# Altium schematic sheet NNLightSwitcher_eMMC_SD.SchDoc
size A4
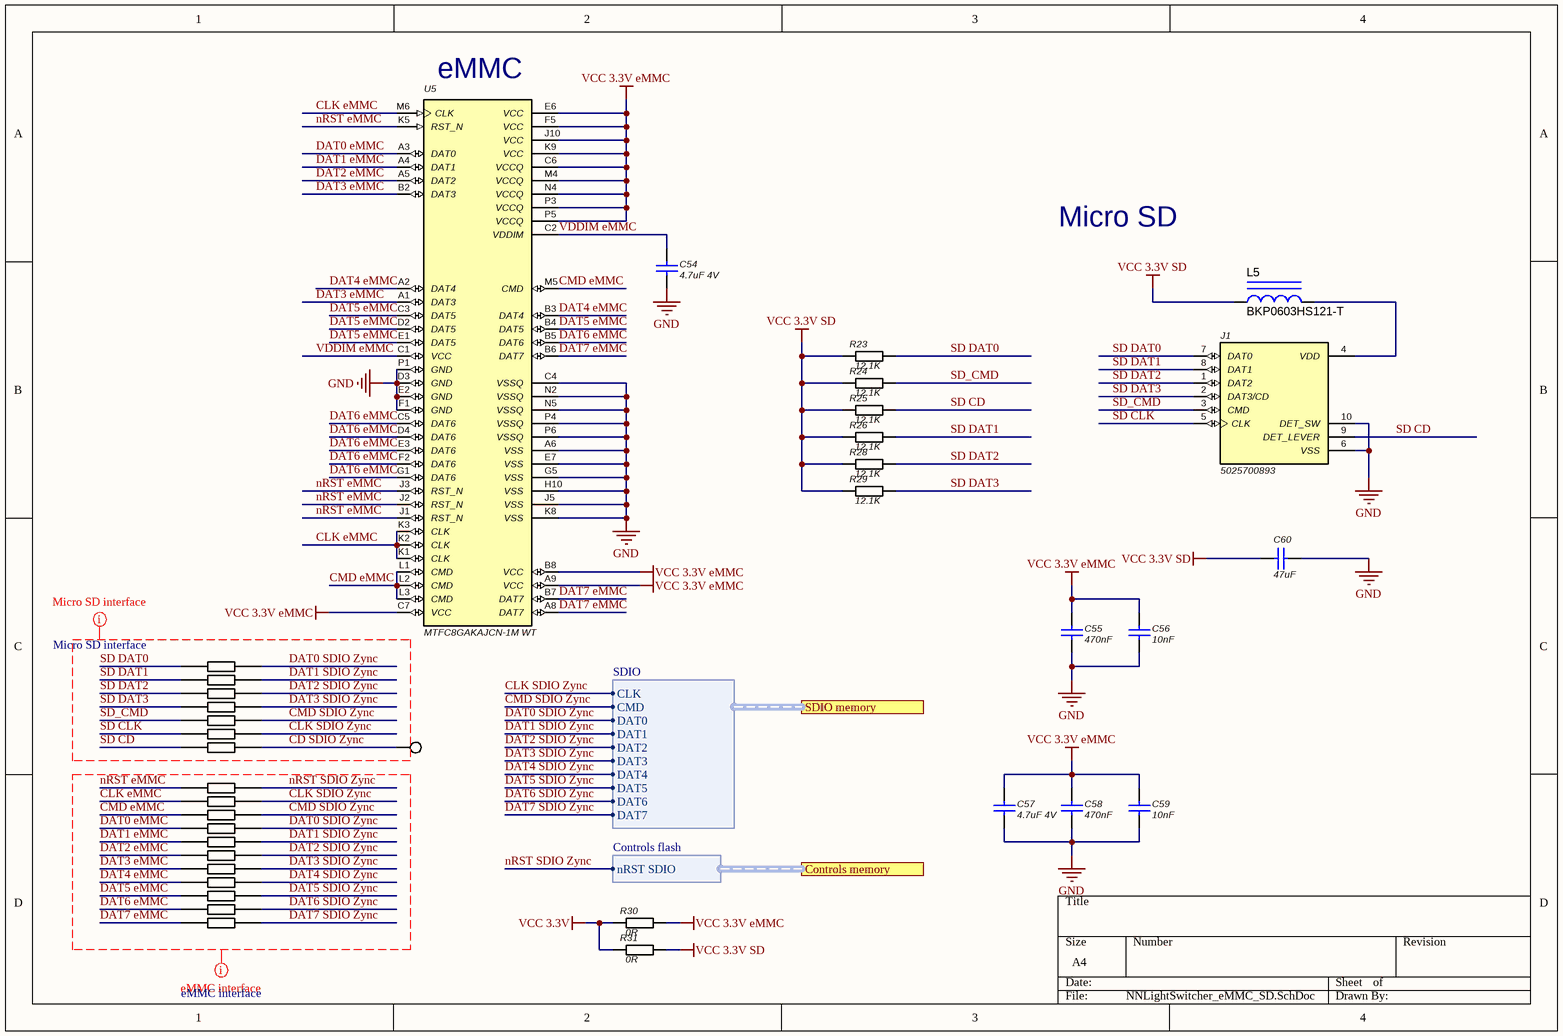
[diagram p0: NNLightSwitcher_eMMC_SD.SchDoc]

## Parts
C54  4.7uF 4V  [0402]
C55  470nF  [0402]
C56  10nF  [0402]
C57  4.7uF 4V  [0402]
C58  470nF  [0402]
C59  10nF  [0402]
C60  47uF  [Res_0805]
J1  5025700893  [MOLEX_5025700893]
L5  BKP0603HS121-T  [*0603]
R23  12.1K  [0402]
R24  12.1K  [0402]
R25  12.1K  [0402]
R26  12.1K  [0402]
R28  12.1K  [0402]
R29  12.1K  [0402]
R30  0R  [0402]
R31  0R  [0402]
RN25  EXB-2HV431JV  [*RESCAXE50P380X160X55-16N]  (value not drawn)  (parts A,B,C,D,E,F,G,H of 8)
RN26  EXB-2HV431JV  [*RESCAXE50P380X160X55-16N]  (value not drawn)  (parts A,B,C,D,E,F,G,H of 8)
RN27  EXB-2HV431JV  [*RESCAXE50P380X160X55-16N]  (value not drawn)  (parts G,H of 8)
TP66  Test point  [Testpoint_with_pad]  (value not drawn)
U5  MTFC8GAKAJCN-1M WT  [*BGA153N50P14X14_1150X1300X100_MTFC4GACAAAM-1M_WT(Primary)]

## Ports
Controls memory (harness Controls flash), SDIO memory (harness SDIO)

## Harnesses
SDIO: CLK, CMD, DAT1, DAT0, DAT3, DAT2, DAT5, DAT4, DAT7, DAT6
Controls flash: nRST SDIO

## Nets
GND: C54.2 C55.2 C56.2 C57.2 C58.2 C59.2 C60.1 J1.6(VSS) J1.10(DET_SW) U5.A6(VSS) U5.C4(VSSQ) U5.D3(GND) U5.E2(GND) U5.E7(VSS) U5.F1(GND) U5.G5(VSS) U5.H10(VSS) U5.J5(VSS) U5.K8(VSS) U5.N2(VSSQ) U5.N5(VSSQ) U5.P1(GND) U5.P4(VSSQ) U5.P6(VSSQ)
VCC 3.3V: R30.1 R31.1
VCC 3.3V eMMC: C55.1 C56.1 C57.1 C58.1 C59.1 R30.2 U5.A9(VCC) U5.B8(VCC) U5.C6(VCCQ) U5.C7(VCC) U5.E6(VCC) U5.F5(VCC) U5.J10(VCC) U5.K9(VCC) U5.M4(VCCQ) U5.N4(VCCQ) U5.P3(VCCQ) U5.P5(VCCQ)
VCC 3.3V SD: C60.2 L5.1 R23.1 R24.1 R25.1 R26.1 R28.1 R29.1 R31.2
CD SDIO Zync: RN25.15 TP66.1
CLK eMMC: RN26.3 U5.K1(CLK) U5.K2(CLK) U5.K3(CLK) U5.M6(CLK)
CLK SDIO Zync: RN25.11 RN26.14 ; port SDIO memory.CLK
CMD eMMC: RN26.6 U5.L1(CMD) U5.L2(CMD) U5.L3(CMD) U5.M5(CMD)
CMD SDIO Zync: RN25.14 RN26.11 ; port SDIO memory.CMD
DAT0 eMMC: RN26.1 U5.A3(DAT0)
DAT0 SDIO Zync: RN25.9 RN26.16 ; port SDIO memory.DAT0
DAT1 eMMC: RN26.2 U5.A4(DAT1)
DAT1 SDIO Zync: RN25.10 RN26.15 ; port SDIO memory.DAT1
DAT2 eMMC: RN26.4 U5.A5(DAT2)
DAT2 SDIO Zync: RN25.12 RN26.13 ; port SDIO memory.DAT2
DAT3 eMMC: RN26.5 U5.A1(DAT3) U5.B2(DAT3)
DAT3 SDIO Zync: RN25.13 RN26.12 ; port SDIO memory.DAT3
DAT4 eMMC: RN26.7 U5.A2(DAT4) U5.B3(DAT4)
DAT4 SDIO Zync: RN26.10 ; port SDIO memory.DAT4
DAT5 eMMC: RN26.8 U5.B4(DAT5) U5.C3(DAT5) U5.D2(DAT5) U5.E1(DAT5)
DAT5 SDIO Zync: RN26.9 ; port SDIO memory.DAT5
DAT6 eMMC: RN27.8 U5.B5(DAT6) U5.C5(DAT6) U5.D4(DAT6) U5.E3(DAT6) U5.F2(DAT6) U5.G1(DAT6)
DAT6 SDIO Zync: RN27.9 ; port SDIO memory.DAT6
DAT7 eMMC: RN27.7 U5.A8(DAT7) U5.B6(DAT7) U5.B7(DAT7)
DAT7 SDIO Zync: RN27.10 ; port SDIO memory.DAT7
nRST eMMC: RN25.1 U5.J1(RST_N) U5.J2(RST_N) U5.J3(RST_N) U5.K5(RST_N)
nRST SDIO Zync: RN25.16 ; port Controls memory.nRST SDIO
SD CD: J1.9(DET_LEVER) R25.2 RN25.2
SD CLK: J1.5(CLK) RN25.6
SD DAT0: J1.7(DAT0) R23.2 RN25.8
SD DAT1: J1.8(DAT1) R26.2 RN25.7
SD DAT2: J1.1(DAT2) R28.2 RN25.5
SD DAT3: J1.2(DAT3/CD) R29.2 RN25.4
SD_CMD: J1.3(CMD) R24.2 RN25.3
VDDIM eMMC: C54.1 U5.C1(VCC) U5.C2(VDDIM)
NetJ1_4: J1.4(VDD) L5.2

## Layout directives
net class eMMC interface: CLK eMMC, CLK SDIO Zync, CMD eMMC, CMD SDIO Zync, DAT0 eMMC, DAT0 SDIO Zync, DAT1 eMMC, DAT1 SDIO Zync, DAT2 eMMC, DAT2 SDIO Zync, DAT3 eMMC, DAT3 SDIO Zync, DAT4 eMMC, DAT4 SDIO Zync, DAT5 eMMC, DAT5 SDIO Zync, DAT6 eMMC, DAT6 SDIO Zync, DAT7 eMMC, DAT7 SDIO Zync, nRST eMMC, nRST SDIO Zync
net class Micro SD interface: CD SDIO Zync, CLK SDIO Zync, CMD SDIO Zync, DAT0 SDIO Zync, DAT1 SDIO Zync, DAT2 SDIO Zync, DAT3 SDIO Zync, SD CD, SD CLK, SD DAT0, SD DAT1, SD DAT2, SD DAT3, SD_CMD

## Notes on the sheet
- (near U5) eMMC
- Micro SD

## Library data of the parts
C54 C57 = Capacitor 4.7uF 4V: ComponentLink1Description: Datasheet link; ComponentLink1URL: http://www.yageo.com/documents/recent/UPY-GP_NP0_16V-to-50V_16.pdf
C55 C58 = Capacitor 470nF: ComponentLink1Description: Datasheet link; ComponentLink1URL: http://www.yageo.com/documents/recent/UPY-GP_NP0_16V-to-50V_16.pdf
C56 C59 = Capacitor 10nF: ComponentLink1Description: Datasheet link; ComponentLink1URL: http://www.yageo.com/documents/recent/UPY-GP_NP0_16V-to-50V_16.pdf
C60 = Capacitor 47uF: ComponentLink1Description: Datasheet link; ComponentLink1URL: http://www.yageo.com/documents/recent/UPY-GP_NP0_16V-to-50V_16.pdf
J1 = Micro SD connector: 1.10mm Pitch microSD Memory Card Connector%2C Normal Mount Surface Mount%2C Push-Push Type; Manufacturer 1: Molex; Current Rating: 500mA; Voltage Rating (AC): 10V; Max Voltage Rating (DC): 1.01kV; Gender: Female; Number of Contacts: 8; Pitch: 1.1mm; Value: 5025700893; Supplier 1: Digi-Key; Manufacturer Part Number 1: 5025700893; Stock 1: 14343; Pricing 1: 1=3,97000, 10=3,81200, 25=3,49440, 50=3,33560, 100=3,17680, 250=2,77972, 500=2,70028 (USD); RoHS: Yes; Mount: Surface Mount,Standard; Contact Material: Copper Alloy,Copper; Contact Plating: Gold; Housing Material: Polymer; Min Operating Temperature: -25°C; Max Operating Temperature: 85°C; Packaging: Tape and Reel; Number of Rows: 1; Package Quantity: 1; Connector Type: Connector; Termination: SMD/SMT; Orientation: Right Angle; Number of Circuits: 8; Length: 13.8mm; Height: 1.8mm; Width: 1.8mm; Depth: 15.5mm; Radiation Hardening: No; REACH SVHC: Unknown; Halogen Free: Low Halogen; Lead Free: Lead Free; ComponentLink1URL: https://datasheet.ciiva.com/684/5025700893-sd-684306.pdf?src-supplier=Digi-Key; ComponentLink1Description: https://datasheet.ciiva.com/684/5025700893-sd-684306.pdf?src-supplier=Digi-Key; ComponentLink2URL: https://datasheet.ciiva.com/4581/5025700893-memory-card-socket-179363-4581107.pdf?src-supplier=Mouser; ComponentLink2Description: https://datasheet.ciiva.com/4581/5025700893-memory-card-socket-179363-4581107.pdf?src-supplier=Mouser; ComponentLink3URL: https://datasheet.ciiva.com/16547/5025700893-memory-card-socket-16547219.pdf?src-supplier=Avnet+Europe; ComponentLink3Description: https://datasheet.ciiva.com/16547/5025700893-memory-card-socket-16547219.pdf?src-supplier=Avnet+Europe; ComponentLink4URL: https://datasheet.ciiva.com/1105/1630840-1105304.pdf?src-supplier=Element14; ComponentLink4Description: https://datasheet.ciiva.com/1105/1630840-1105304.pdf?src-supplier=Element14; ComponentLink5URL: https://datasheet.ciiva.com/11755/0900766b80f7529e-11755048.pdf?src-supplier=RSComponents; ComponentLink5Description: https://datasheet.ciiva.com/11755/0900766b80f7529e-11755048.pdf?src-supplier=RSComponents; ComponentLink6URL: https://datasheet.ciiva.com/15174/getdatasheetpartid-321553-15174794.pdf?src-supplier=Verical; ComponentLink6Description: https://datasheet.ciiva.com/15174/getdatasheetpartid-321553-15174794.pdf?src-supplier=Verical; ComponentLink7URL: https://datasheet.ciiva.com/1104/ps-502570-001-1104669.pdf?src-supplier=Element14; ComponentLink7Description: https://datasheet.ciiva.com/1104/ps-502570-001-1104669.pdf?src-supplier=Element14; ComponentLink8URL: https://datasheet.ciiva.com/684/5025700893-sd-684307.pdf?src-supplier=Digi-Key; ComponentLink8Description: https://datasheet.ciiva.com/684/5025700893-sd-684307.pdf?src-supplier=Digi-Key; ComponentLink9URL: https://datasheet.ciiva.com/684/5025700893-sd-684308.pdf?src-supplier=Digi-Key; ComponentLink9Description: https://datasheet.ciiva.com/684/5025700893-sd-684308.pdf?src-supplier=Digi-Key; ComponentLink10URL: https://datasheet.ciiva.com/16469/5025700893-memory-card-socket-16469082.pdf?src-supplier=Avnet+Asia; ComponentLink10Description: https://datasheet.ciiva.com/16469/5025700893-memory-card-socket-16469082.pdf?src-supplier=Avnet+Asia; ComponentLink11URL: https://datasheet.ciiva.com/3121/5025700893-memory-card-socket-3121179.pdf?src-supplier=Avnet; ComponentLink11Description: https://datasheet.ciiva.com/3121/5025700893-memory-card-socket-3121179.pdf?src-supplier=Avnet; Supplier Part Number 1: WM19093CT-ND
L5 = BKP0603HS121-T: Inductor, Multilayer, Ferrite bad; PartNumber: LQG15HS3N9S02D; Manufacturer: MuRata; Value: 3.9nH; Imax_A: 750mA; Irms: 0.75A @ 25C rise; DCR_ohm: 0.14; Value1: 0.14 ohm; Value2: 0.75A; Material: Air Core; Green_Lifecycle: Active; SizeAreaWB_mm2: 3; Green_REACh: Passed; SizeZ_mm: 0.55; SizeX_mm: 1; SizeY_mm: 0.5; AEC Qualified: N; AEC Category: Q200; CompType: Inductor; PackageReference: 0402 polarized; Ind_H: 3.9nH; Technology: Multilayer; MountType: SMT; ComponentLink1Description: Datasheet link; ComponentLink1URL: https://search.murata.co.jp/Ceramy/image/img/P02/JELF243B-0010.pdf; RoHS: Y; Supplier 1: Digi-Key; Supplier Part Number 1: 490-2617-1-ND; Supplier 2: Mouser; Supplier Part Number 2: 81-LQG15HS3N9S02D; Green_EU RoHS-2: Incomplete; Green_EU RoHS: Passed; SizeArea_mm2: 0.5; AEC Grade: N/A; Value: BKP0603HS121-T
R23-R26 R28 R29 = Resistor 12.1K
R30 R31 = Resistor 0R
RN25-RN27 = EXB-2HV431JV: Res Thick Film Array; Value: 33 R
TP66 = Test point: Test Point, Miniature, SMT; ComponentLink1Description: Datasheet URL; ComponentLink1URL: http://www.keyelco.com/userAssets/store/files/5015.PDF
U5 = MTFC4GACAAAM-1M_WT: J54A eMMC 32G ECCN: 3A991 / HTS: 8542.32.0070; Manufacturer 1: Micron Technology; Manufacturer Part Number 1: MTFC4GACAJCN-4MITTR; Pricing 1: 1=10,20000, 10=9,40000, 25=9,21000, 50=9,16000, 100=8,23000, 250=7,98000, 500=7,58000, 1000=6,66000, 2000=6,17000, 10000=6,66000 (USD); RoHS: No; Stock 1: 4219; Supplier 1: Mouser; Supplier Part Number 1: 340-294892-REEL